# Altium schematic sheet PowerSystem.SchDoc
size A; SheetNumber: 10; SheetTotal: 15
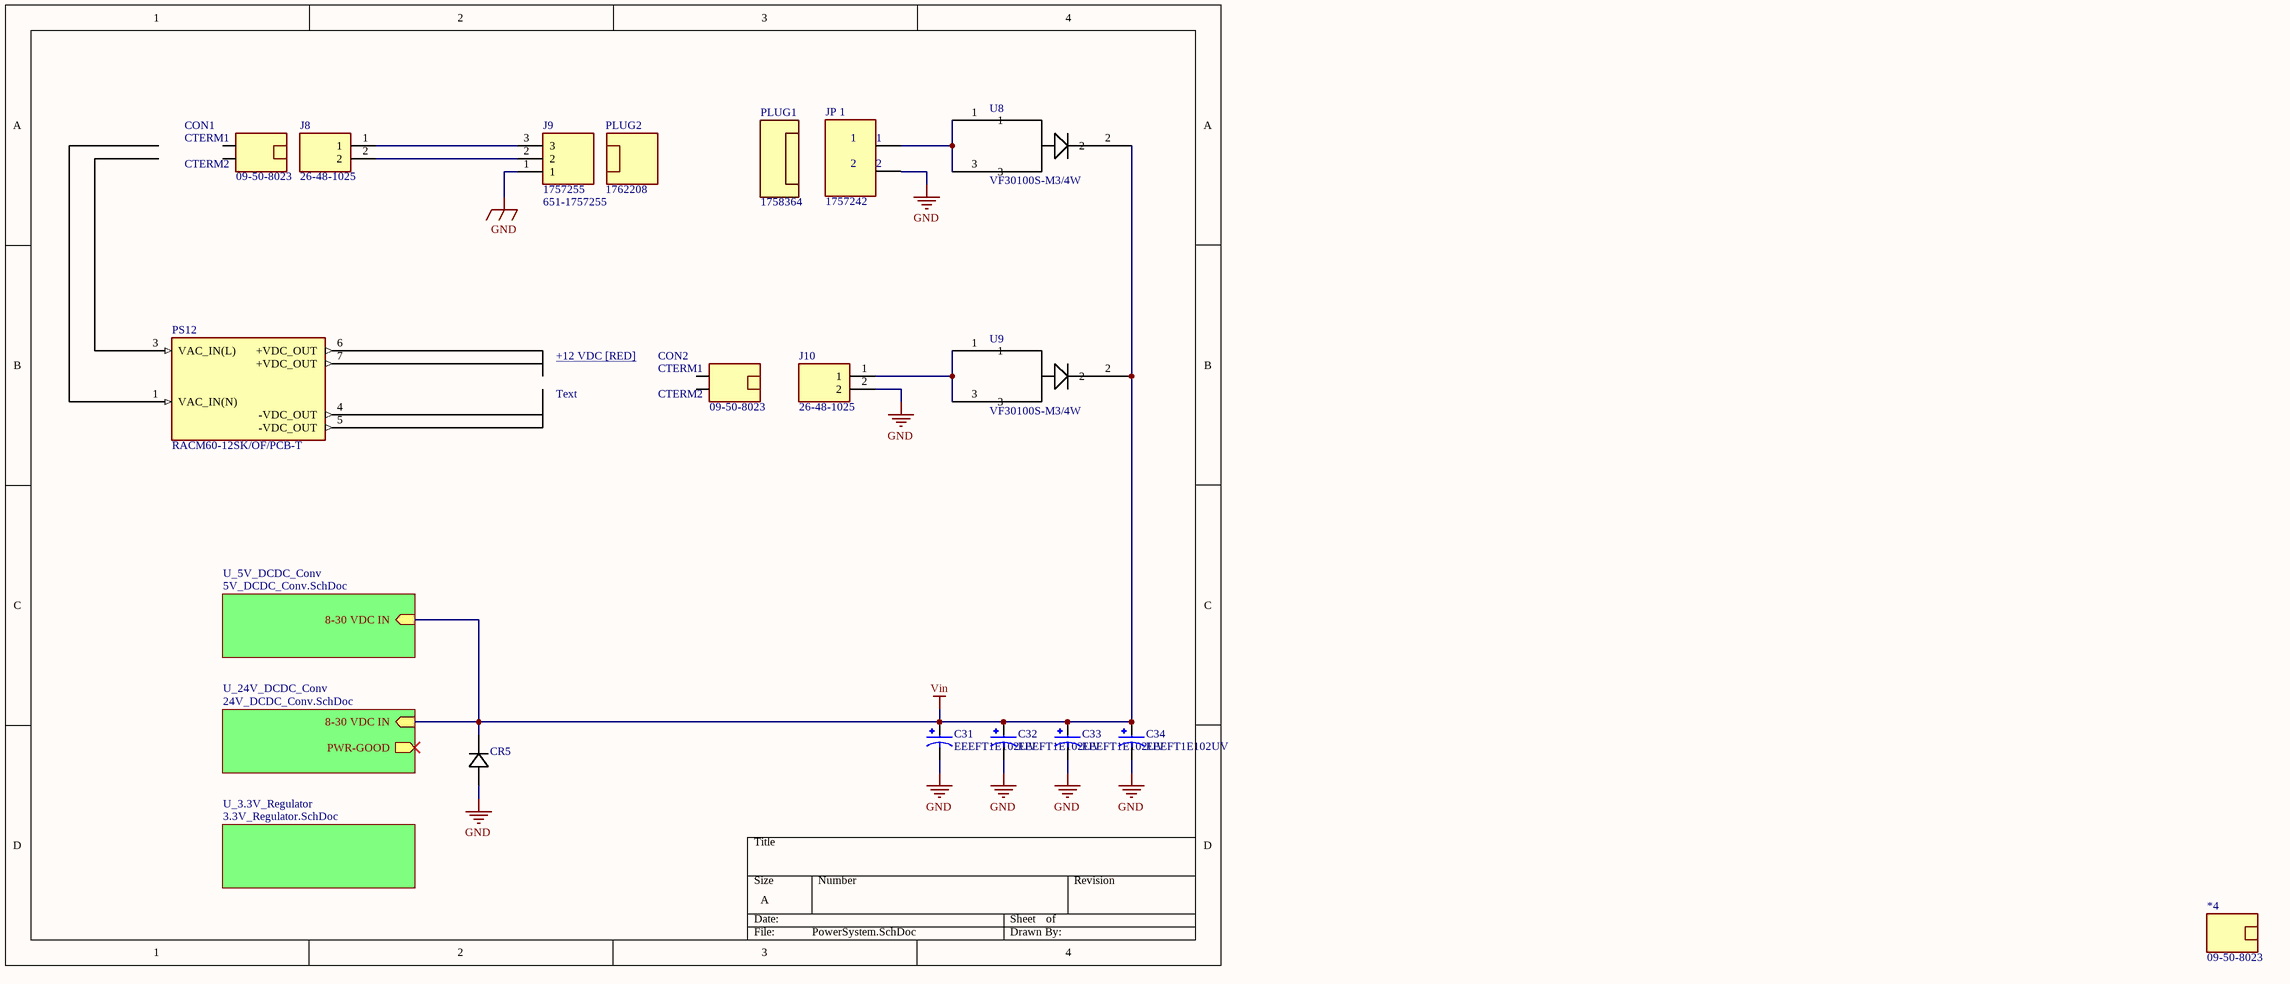
[diagram p0: PowerSystem.SchDoc]

## Parts
*4  09-50-8023  [Connector_09-50-8023]
C31  EEEFT1E102UV  [CAP_EEEFT1E102UV]
C32  EEEFT1E102UV  [CAP_EEEFT1E102UV]
C33  EEEFT1E102UV  [CAP_EEEFT1E102UV]
C34  EEEFT1E102UV  [CAP_EEEFT1E102UV]
CON1  09-50-8023  [Connector_09-50-8023]
CON2  09-50-8023  [Connector_09-50-8023]
CR5  1KSMB39CA  [1KSMBSeries_LTF]  (value not drawn)
J8  26-48-1025  [SHDR2W155P0X396_1X2_732X902X1468P]
J9  1757255  Supplier Part Number 1: 651-1757255  [SHDRRA3W103P0X508_1X3_1724X1200X875P]
J10  26-48-1025  [SHDR2W155P0X396_1X2_732X902X1468P]
JP_1  1757242  [PHOENIX_1757242]
PLUG1  1758364  [Connector_1758364]
PLUG2  1762208  [Connector_1762208]
PS12  RACM60-12SK/OF/PCB-T  [CONV_RACM60-12SK/OF/PCB-T]  (graphical)
U8  VF30100S-M3/4W  [TO_0S-M3/4W_VIS]
U9  VF30100S-M3/4W  [TO_0S-M3/4W_VIS]

## Sub-sheets
U_3.3V_Regulator = 3.3V_Regulator.SchDoc: no entries
U_5V_DCDC_Conv = 5V_DCDC_Conv.SchDoc: 8-30 VDC IN (in)
U_24V_DCDC_Conv = 24V_DCDC_Conv.SchDoc: PWR-GOOD (out), 8-30 VDC IN (in)

## Nets
GND: C31.2 C32.2 C33.2 C34.2 CR5.2 J9.1 J10.2
Vin: C31.1 C32.1 C33.1 C34.1 CR5.1 U8.2 U9.2 ; sheet U_5V_DCDC_Conv/8-30 VDC IN, sheet U_24V_DCDC_Conv/8-30 VDC IN
NetJ8_1: J8.1 J9.3
NetJ8_2: J8.2 J9.2
NetJ10_1: J10.1 U9.1 U9.3
NetU8_1: U8.1 U8.3

Not connected (* = marked no-connect by the designer): PS12 1(VAC_IN(N)) 3(VAC_IN(L)) 4(-VDC_OUT) 5(-VDC_OUT) 6(+VDC_OUT) 7(+VDC_OUT)

## Notes on the sheet
- +12 VDC [RED] <PWR-RTN [GRN]>
- Text
- (in symbol 09-50-8023) CTERM1; CTERM2
- (in symbol 1757242) 1; 2

## Library data of the parts
*4 CON1 CON2 = 09-50-8023: Connector Housing Receptacle 2 Position 3.96mm Straight Bag; Manufacturer: Molex; Body Material: PBT,Polyester; Number of Contacts: 2; Max Voltage Rating (AC): 250V; Max Current Rating: 7A; Gender: Female; Approvals: UL,CSA; Supplier 1: Mouser; Manufacturer Part Number: 09-50-8023; RoHS: Yes; Category: Connectors; Pricing 1: 1=0.22000, 10=0.17700, 50=0.17700, 100=0.12700, 1000=0.10000, 10000=0.07700 (USD); Mount: Free Hanging,Cable; Housing Color: Natural; Housing Material: Polyester; Color: Natural; Material: Polyester; Min Operating Temperature: 0°C; Max Operating Temperature: 75°C; Orientation: Straight; Number of Rows: 1; Packaging: Bulk; Series: KK® 41695; Contact Gender: Female; Package Quantity: 2500; Connector Type: Receptacle; Number of Positions: 2; Termination: Crimp; Fastening Type: Ramp; Contact Type: Non-Gendered; Length: 8.79mm; Width: 15.88mm; Height: 8.07mm; Pitch: 3.96mm; Depth: 15.88mm; Radiation Hardening: No; REACH SVHC: Unknown; RoHS Compliant: Yes; Lead Free: Lead Free; Flammability Rating: UL94 V-0; ComponentLink1URL: https://datasheet.ciiva.com/10401/0009508023-crimp-housings-10401153.pdf?src-supplier=Avnet; ComponentLink1Description: https://datasheet.ciiva.com/10401/0009508023-crimp-housings-10401153.pdf?src-supplier=Avnet; ComponentLink2URL: https://datasheet.ciiva.com/1111/99335-1111034.pdf?src-supplier=Element14; ComponentLink2Description: https://datasheet.ciiva.com/1111/99335-1111034.pdf?src-supplier=Element14; ComponentLink3URL: https://datasheet.ciiva.com/19473/1960927-19473582.pdf?src-supplier=Jameco; ComponentLink3Description: https://datasheet.ciiva.com/19473/1960927-19473582.pdf?src-supplier=Jameco; ComponentLink4URL: https://datasheet.ciiva.com/18453/70190765-18453861.pdf?src-supplier=Allied+Electronics; ComponentLink4Description: https://datasheet.ciiva.com/18453/70190765-18453861.pdf?src-supplier=Allied+Electronics; ComponentLink5URL: https://datasheet.ciiva.com/19473/736747-19473771.pdf?src-supplier=Jameco; ComponentLink5Description: https://datasheet.ciiva.com/19473/736747-19473771.pdf?src-supplier=Jameco; ComponentLink6URL: https://datasheet.ciiva.com/15217/getdatasheetpartid-309062-15217245.pdf?src-supplier=Verical; ComponentLink6Description: https://datasheet.ciiva.com/15217/getdatasheetpartid-309062-15217245.pdf?src-supplier=Verical; ComponentLink7URL: https://datasheet.ciiva.com/16661/0009508023-crimp-housings-16661293.pdf?src-supplier=Avnet+Europe; ComponentLink7Description: https://datasheet.ciiva.com/16661/0009508023-crimp-housings-16661293.pdf?src-supplier=Avnet+Europe; Supplier Part Number 1: 538-09-50-8023; Stock 1: 12416
C31-C34 = EEEFT1E102UV: ÐšÐ Ð«Ð¨ÐšÐ ÐšÐ›Ð®Ð§Ð•Ð’ÐÐ¯ 1000 Ð¼ÐºÐ¤ 20% 25 Ð’ Ð´Ð»Ñ Ð¿Ð¾Ð²ÐµÑ€Ñ…Ð½Ð¾ÑÑ‚Ð½Ð¾Ð³Ð¾ Ð¼Ð¾Ð½Ñ‚Ð°Ð¶Ð°; MP: EEE-FT1E102UV; MF: Panasonic Electronic Components; Package: RADIAL-2 Panasonic; Purchase-URL: https://pricing.snapeda.com/search/part/EEE-FT1E102UV/?ref=eda; Check_prices: https://www.snapeda.com/parts/EEE-FT1E102UV/Panasonic/view-part/6178335/?ref=eda; Value: *; SnapEDA_Link: https://www.snapeda.com/parts/EEE-FT1E102UV/Panasonic/view-part/6178335/?ref=snap; Price: None; Availability: In Stock
CR5 = 1KSMB39CA: No Description Available; Mfr_Name: Littelfuse Inc; Type: DEV; Copyright: Copyright (C) 2021 Ultra Librarian. All rights reserved.; Manufacturer_Part_Number: 1KSMB39CA; RefDes: RefDes
J8 J10 = 26-48-1025: Connector; Manufacturer_Name: Molex; Datasheet Link: https://www.molex.com/pdm_docs/sd/026481025_sd.pdf; Height: 14.68mm; Manufacturer_Part_Number: 26-48-1025; Mouser Part Number: 538-26-48-1025; Mouser Price/Stock: https://www.mouser.co.uk/ProductDetail/Molex/26-48-1025?qs=Vtbn2VVmZzHbNAFdpV%2FLOg%3D%3D; Supplier 1: Digi-Key; Supplier Part Number 1: WM50008-02-ND
J9 = 1757255: Connector; Manufacturer_Name: Phoenix Contact; Datasheet Link: https://datasheet.datasheetarchive.com/originals/distributors/SFDatasheet-2/sf-00051650.pdf; Height: 8.75mm; Manufacturer_Part_Number: 1757255; Mouser Part Number: 651-1757255; Mouser Price/Stock: https://www.mouser.co.uk/ProductDetail/Phoenix-Contact/1757255?qs=uD%2FdkN7XIa0ez8xszzicKg%3D%3D; Arrow Part Number: 1757255; Arrow Price/Stock: https://www.arrow.com/en/products/1757255/phoenix-contact?region=nac; Supplier 1: Mouser
JP_1 = 1757242: 2 Position Terminal Block Header, Male Pins, Shrouded _4 Side_ 0.200 _5.08mm_ 90Â°, Right Angle Through Hole; MF: Phoenix Contact; Package: None; Digi-Key_Part_Number: 277-1106-ND; MP: 1757242; Digi-Key_Purchase_URL: https://www.digikey.ch/product-detail/en/phoenix-contact/1757242/277-1106-ND/260474?utm_source=snapeda&utm_medium=aggregator&utm_campaign=symbol; Value: *; SnapEDA_Link: https://www.snapeda.com/parts/1757242/Phoenix%20Contact/view-part/228512/?ref=snap; Supplier 1: Mouser; Supplier Part Number 1: 651-1757242
PLUG1 = 1758364: Conn Terminal Block F 2 POS 5.08mm Screw RA Cable Mount 12A; Manufacturer: Phoenix Contact; Voltage Rating: 250V; Number of Positions: 2; Number of Levels: 1; Current: 15A; Voltage: 300V; Gender: Female; Wire Gauge (Max): 12AWG; Wire Gauge (Min): 24AWG; Stripping Length: 7mm; Supplier 1: Digi-Key; Manufacturer Part Number: 1758364; RoHS: Yes; Category: Terminal Blocks; Stock 1: 1385; Pricing 1: 1=2.18000, 10=2.11900, 50=1.98000, 100=1.82160, 250=1.68300, 500=1.60380, 1000=1.52460 (USD); Mount: Free Hanging,Plug-In; Contact Plating: Tin; Color: Green; Contact Material: Tin; Weight: 0.133336oz; Housing Color: Green; Current Rating: 12A; Package Quantity: 50; Max Current Rating: 12A; Packaging: Bulk; Termination: Screw; Number of Positions Per Level: 2; Number of Contacts: 2; Connector Type: Screw; Number of Rows: 1; Series: COMBICON MSTB; Number of Poles: 2; Length: 10.16mm; Width: 18.3mm; Height: 15mm; Pitch: 5.08mm; RoHS Compliant: Yes; ComponentLink1URL: https://datasheet.ciiva.com/796/1758364-796729.pdf?src-supplier=Digi-Key; ComponentLink1Description: https://datasheet.ciiva.com/796/1758364-796729.pdf?src-supplier=Digi-Key; ComponentLink2URL: https://datasheet.ciiva.com/16096/1758364-16096513.pdf?src-supplier=Onlinecomponents.com; ComponentLink2Description: https://datasheet.ciiva.com/16096/1758364-16096513.pdf?src-supplier=Onlinecomponents.com; ComponentLink3URL: https://datasheet.ciiva.com/14607/70055300-14607547.pdf?src-supplier=Allied+Electronics; ComponentLink3Description: https://datasheet.ciiva.com/14607/70055300-14607547.pdf?src-supplier=Allied+Electronics; ComponentLink4URL: https://datasheet.ciiva.com/29222/569586-da-01-en-steckerteil-1758364-50-st-29222742.pdf?src-supplier=Conrad; ComponentLink4Description: https://datasheet.ciiva.com/29222/569586-da-01-en-steckerteil-1758364-50-st-29222742.pdf?src-supplier=Conrad; Supplier Part Number 1: 277-1964-ND
PLUG2 = 1762208: Plug, Terminal Block; 12 A; 250 V; 5.08 mm; 3 position, screw, Pre-Printed; Manufacturer: Phoenix Contact; Voltage Rating: 250V; Number of Poles: 3; Max Current Rating: 12A; Number of Levels: 1; Current: 15A; Voltage: 300V; Gender: Female; Pitch: 5.08mm; Wire Gauge (Max): 30AWG; Wire Gauge (Min): 12AWG; Stripping Length: 7mm; Supplier 1: Digi-Key; Manufacturer Part Number: 1762208; RoHS: Yes; Category: Terminal Blocks; Pricing 1: 1=3.21000, 10=3.12400, 50=2.92000, 100=2.68640, 250=2.48200, 500=2.36520, 1000=2.24840 (USD); Mount: Free Hanging,Plug-In,Cable; Color: Green; Contact Plating: Tin; Weight: 0.190479oz; Housing Color: Green; Housing Material: Plastic; Contact Material: Tin; Material: Polyamide; Package Quantity: 50; Packaging: Bulk; Termination: Screw; Series: COMBICON MSTB; Current Rating: 12A; Number of Positions Per Level: 3; Number of Positions: 3; Number of Contacts: 3; Number of Rows: 1; Connector Type: Screw; Orientation: Right Angle; Number of Circuits: 3; Length: 15mm; Width: 10.16mm; Height: 15.24mm; RoHS Compliant: Yes; Flammability Rating: UL94 V-0; ComponentLink1URL: https://datasheet.ciiva.com/795/1762208-795480.pdf?src-supplier=Digi-Key; ComponentLink1Description: https://datasheet.ciiva.com/795/1762208-795480.pdf?src-supplier=Digi-Key; ComponentLink2URL: https://datasheet.ciiva.com/3970/1762208-3970503.pdf?src-supplier=Arrow+Electronics; ComponentLink2Description: https://datasheet.ciiva.com/3970/1762208-3970503.pdf?src-supplier=Arrow+Electronics; ComponentLink3URL: https://datasheet.ciiva.com/16071/1762208-16071547.pdf?src-supplier=Onlinecomponents.com; ComponentLink3Description: https://datasheet.ciiva.com/16071/1762208-16071547.pdf?src-supplier=Onlinecomponents.com; ComponentLink4URL: https://datasheet.ciiva.com/14608/70055301-14608154.pdf?src-supplier=Allied+Electronics; ComponentLink4Description: https://datasheet.ciiva.com/14608/70055301-14608154.pdf?src-supplier=Allied+Electronics; ComponentLink5URL: https://datasheet.ciiva.com/29219/567120-da-01-en-steckerteil-1762208-50-st-29219722.pdf?src-supplier=Conrad; ComponentLink5Description: https://datasheet.ciiva.com/29219/567120-da-01-en-steckerteil-1762208-50-st-29219722.pdf?src-supplier=Conrad; Supplier Part Number 1: 277-1965-ND; Stock 1: 761
PS12 = RACM60-12SK/OF/PCB-T: Open Frame AC DC Converters 1 Uitgang 24V 2.5A 80 ~ 264 VAC, 120 ~ 370 VDC Input; Package: None; Price: None; Value: *; MP: RACM60-12SK/OF/PCB-T; Availability: Unavailable
U8 U9 = VF30100S-M3/4W: No Description Available; Mfr_Name: Vishay; Copyright: Copyright (C) 2021 Ultra Librarian. All rights reserved.; Manufacturer_Part_Number: VF30100S-M3/4W; RefDes: RefDes; Type: DEV